# EAGLE design EE297 PCB (EAGLE 7.1.0)
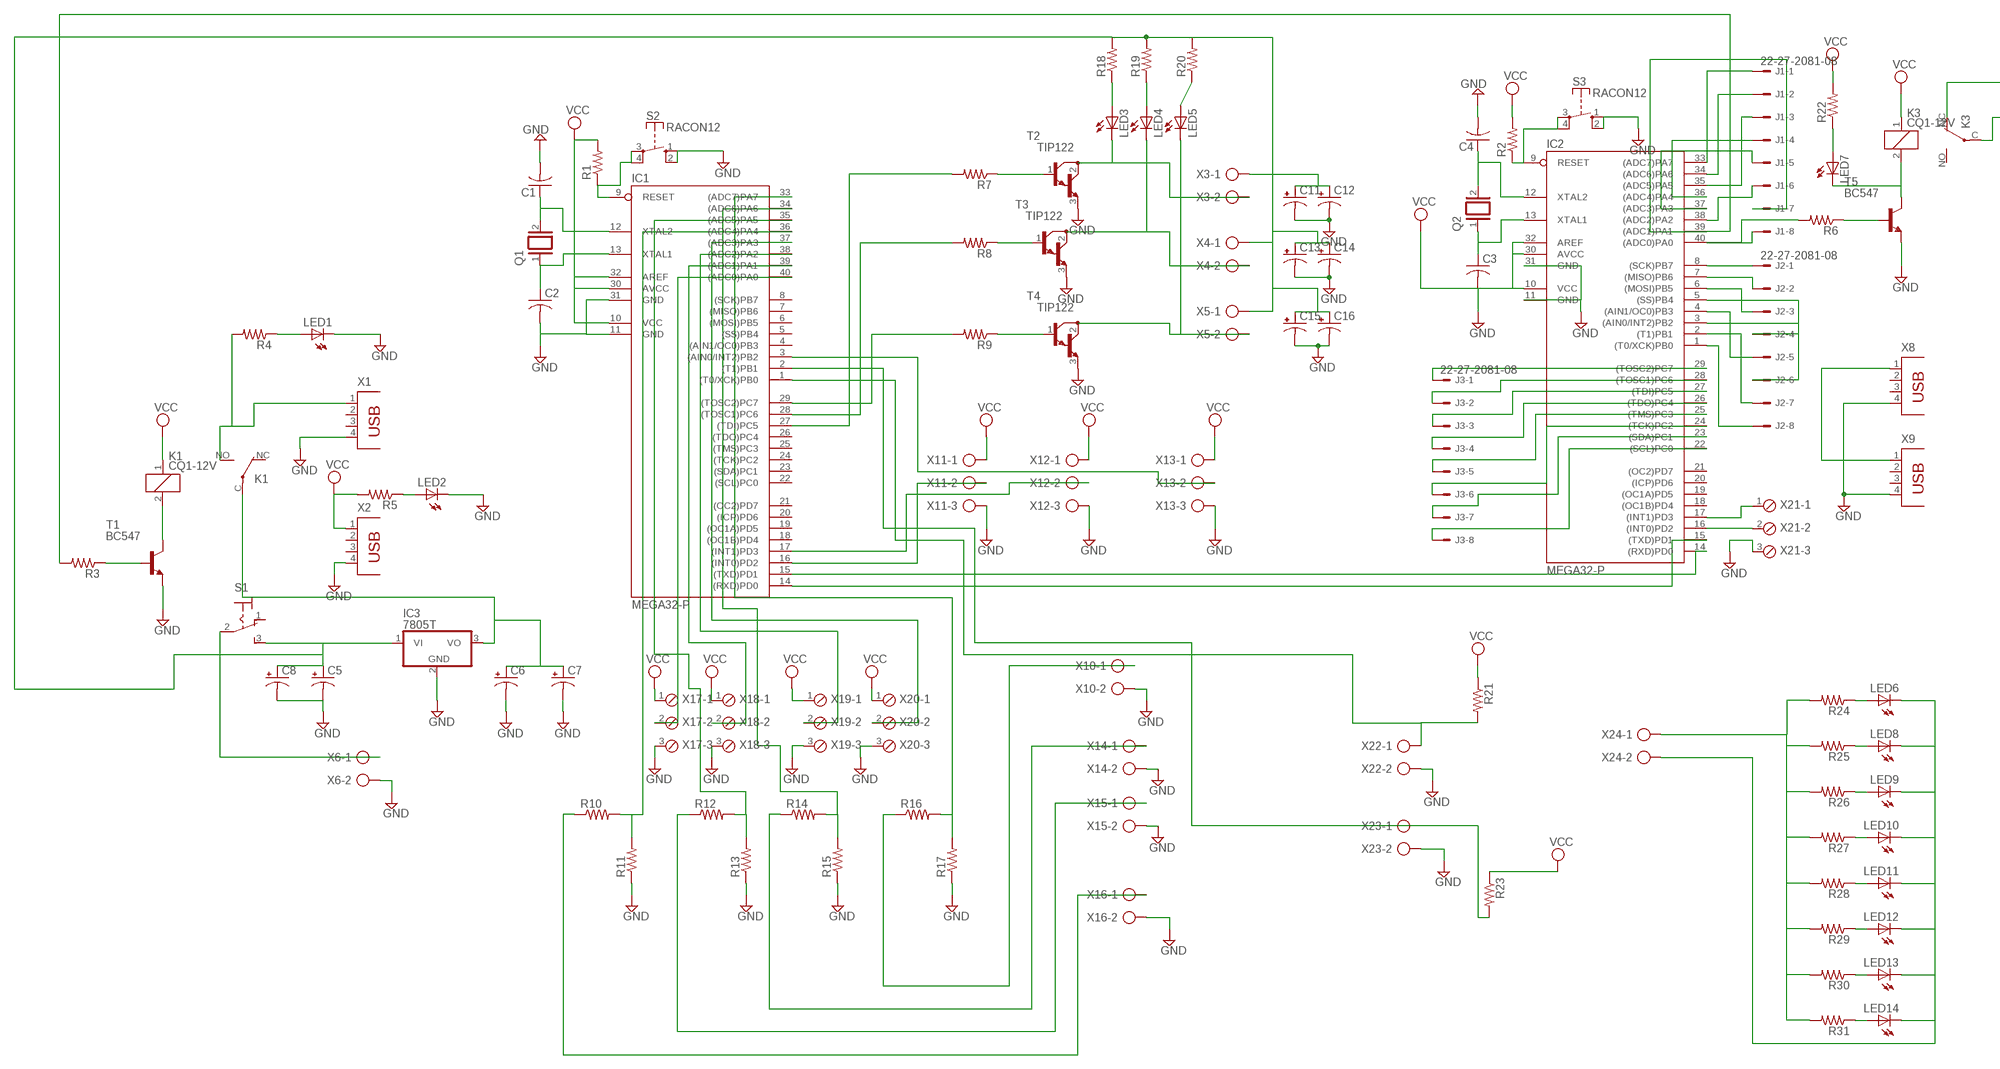
[diagram p0: schematic, sheet 1, part 1 of 2]
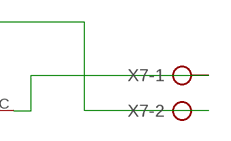
[diagram p1: schematic, sheet 1, part 2 of 2]

## Parts
C1  C-US050H075X075  [C050H075X075]
C2  C-US050H075X075  [C050H075X075]
C3  C-US050H075X075  [C050H075X075]
C4  C-US050H075X075  [C050H075X075]
C5  CPOL-USE7.5-18  [E7,5-18]
C6  CPOL-USE7.5-18  [E7,5-18]
C7  CPOL-USE7.5-18  [E7,5-18]
C8  CPOL-USE7.5-18  [E7,5-18]
C11  CPOL-USE7.5-18  [E7,5-18]
C12  CPOL-USE7.5-18  [E7,5-18]
C13  CPOL-USE7.5-18  [E7,5-18]
C14  CPOL-USE7.5-18  [E7,5-18]
C15  CPOL-USE7.5-18  [E7,5-18]
C16  CPOL-USE7.5-18  [E7,5-18]
IC1  MEGA32-P  [DIL40]
IC2  MEGA32-P  [DIL40]
IC3  7805T  [TO220H]
J1  22-27-2081-08  [6410-08]
J2  22-27-2081-08  [6410-08]
J3  22-27-2081-08  [6410-08]
K1  CQ1-12V  [CQ1]
K3  CQ1-12V  [CQ1]
LED1  LED5MM  [LED5MM]
LED2  LED5MM  [LED5MM]
LED3  LED5MM  [LED5MM]
LED4  LED5MM  [LED5MM]
LED5  LED5MM  [LED5MM]
LED6  LED5MM  [LED5MM]
LED7  LED5MM  [LED5MM]
LED8  LED5MM  [LED5MM]
LED9  LED5MM  [LED5MM]
LED10  LED5MM  [LED5MM]
LED11  LED5MM  [LED5MM]
LED12  LED5MM  [LED5MM]
LED13  LED5MM  [LED5MM]
LED14  LED5MM  [LED5MM]
Q1  XTAL  [Q]
Q2  XTAL  [Q]
R1  R-US_0207/10  [0207/10]
R2  R-US_0207/10  [0207/10]
R3  R-US_0207/10  [0207/10]
R4  R-US_0207/10  [0207/10]
R5  R-US_0207/10  [0207/10]
R6  R-US_0207/10  [0207/10]
R7  R-US_0207/10  [0207/10]
R8  R-US_0207/10  [0207/10]
R9  R-US_0207/10  [0207/10]
R10  R-US_0207/10  [0207/10]
R11  R-US_0207/10  [0207/10]
R12  R-US_0207/10  [0207/10]
R13  R-US_0207/10  [0207/10]
R14  R-US_0207/10  [0207/10]
R15  R-US_0207/10  [0207/10]
R16  R-US_0207/10  [0207/10]
R17  R-US_0207/10  [0207/10]
R18  R-US_0207/10  [0207/10]
R19  R-US_0207/10  [0207/10]
R20  R-US_0207/10  [0207/10]
R21  R-US_0207/10  [0207/10]
R22  R-US_0207/10  [0207/10]
R23  R-US_0207/10  [0207/10]
R24  R-US_0207/10  [0207/10]
R25  R-US_0207/10  [0207/10]
R26  R-US_0207/10  [0207/10]
R27  R-US_0207/10  [0207/10]
R28  R-US_0207/10  [0207/10]
R29  R-US_0207/10  [0207/10]
R30  R-US_0207/10  [0207/10]
R31  R-US_0207/10  [0207/10]
S1  320-916  [320-916]
S2  RACON12  [RACON12]
S3  RACON12  [RACON12]
T1  BC547  [TO92]
T2  TIP122  [TO220]
T3  TIP122  [TO220]
T4  TIP122  [TO220]
T5  BC547  [TO92]
X1  PN87520  [PN87520]
X2  PN87520  [PN87520]
X3  AK300/2  [AK300/2]
X4  AK300/2  [AK300/2]
X5  AK300/2  [AK300/2]
X6  AK300/2  [AK300/2]
X7  AK300/2  [AK300/2]
X8  PN87520  [PN87520]
X9  PN87520  [PN87520]
X10  AK300/2  [AK300/2]
X11  AK300/3  [AK300/3]
X12  AK300/3  [AK300/3]
X13  AK300/3  [AK300/3]
X14  AK300/2  [AK300/2]
X15  AK300/2  [AK300/2]
X16  AK300/2  [AK300/2]
X17  MPT3  [3POL254]
X18  MPT3  [3POL254]
X19  MPT3  [3POL254]
X20  MPT3  [3POL254]
X21  MPT3  [3POL254]
X22  AK300/2  [AK300/2]
X23  AK300/2  [AK300/2]
X24  AK300/2  [AK300/2]

## Nets
GND: C1.2 C2.2 C3.2 C4.2 C5.- C6.- C7.- C8.- C11.- C12.- C13.- C14.- C15.- C16.- IC1.11(GND) IC1.31(GND) IC3.2(GND) LED1.K(C) LED2.K(C) R11.1 R13.1 R15.1 R17.1 S2.1(S) S2.2(S) S3.1(S) S3.2(S) T1.1(E) T2.3(E) T3.3(E) T4.3(E) T5.1(E) X1.4 X2.4 X6.2 X8.4 X9.4 X10.2 X11.3 X12.3 X13.3 X14.2 X15.2 X16.2 X17.3 X18.3 X19.3 X20.3 X21.3 X22.2 X23.2
GND8: LED6.K(C) LED8.K(C) LED9.K(C) LED10.K(C) LED11.K(C) LED12.K(C) LED13.K(C) LED14.K(C) X24.2
N$1: S1.2(P) X6.1
N$2: K3.C(2:P) X7.1
N$3: C6.+ C7.+ IC3.3(VO) K1.C(2:P)
N$4: IC1.14((RXD)PD0) IC2.15((TXD)PD1)
N$5: R3.1 T1.2(B)
N$6: K1.2 T1.3(C)
N$7: K1.NO(2:S) R4.2 X1.1
N$8: IC1.9(RESET) R1.1 S2.3(P) S2.4(P)
N$9: IC1.1((T0/XCK)PB0) R21.2 X22.1
N$10: C1.1 IC1.12(XTAL2) Q1.2
N$11: C2.1 IC1.13(XTAL1) Q1.1
N$12: IC1.15((TXD)PD1) IC2.14((RXD)PD0)
N$13: IC1.40((ADC0)PA0) X17.2
N$14: IC2.9(RESET) R2.1 S3.3(P) S3.4(P)
N$15: IC1.39((ADC1)PA1) X18.2
N$16: IC1.38((ADC2)PA2) X19.2
N$17: C4.1 IC2.12(XTAL2) Q2.2
N$18: C3.1 IC2.13(XTAL1) Q2.1
N$19: IC1.37((ADC3)PA3) X20.2
N$20: IC1.2((T1)PB1) R23.2 X23.1
N$21: IC1.35((ADC5)PA5) R12.2 R13.2
N$22: IC1.34((ADC6)PA6) R14.2 R15.2
N$23: LED1.A R4.1
N$24: LED2.A R5.1
N$25: IC1.33((ADC7)PA7) R16.2 R17.2
N$26: IC2.11(GND) IC2.31(GND)
N$27: R6.1 T5.2(B)
N$28: K3.2 LED7.K(C) T5.3(C)
N$29: LED4.A R19.1
N$30: IC1.16((INT0)PD2) X11.2
N$31: IC1.17((INT1)PD3) X12.2
N$32: IC1.3((AIN0/INT2)PB2) X13.2
N$33: IC1.29((TOSC2)PC7) R9.2
N$34: IC1.28((TOSC1)PC6) R8.2
N$35: IC1.27((TDI)PC5) R7.2
N$36: R7.1 T2.1(B)
N$37: R8.1 T3.1(B)
N$38: R9.1 T4.1(B)
N$39: LED5.K(C) T4.2(C) X5.2
N$40: LED4.K(C) T3.2(C) X4.2
N$41: LED3.K(C) T2.2(C) X3.2
N$42: K3.NC(2:O) X7.2
N$43: LED5.A R20.1
N$44: IC2.40((ADC0)PA0) J1.8 R6.2
N$45: IC2.39((ADC1)PA1) J1.7 R3.2
N$46: IC2.17((INT1)PD3) X21.1
N$47: C5.+ C8.+ C11.+ C12.+ C13.+ C14.+ C15.+ C16.+ IC3.1(VI) R18.2 R19.2 R20.2 S1.3(S) X3.1 X4.1 X5.1
N$48: IC2.16((INT0)PD2) X21.2
N$49: X8.1 X9.1
N$50: LED3.A R18.1
N$51: R10.1 X16.1
N$52: R12.1 X15.1
N$53: R14.1 X14.1
N$54: R16.1 X10.1
N$55: IC1.36((ADC4)PA4) R10.2 R11.2
N$57: LED7.A R22.1
N$58: LED6.A R24.1
N$59: LED8.A R25.1
N$60: LED9.A R26.1
N$61: LED10.A R27.1
N$62: LED11.A R28.1
N$63: LED12.A R29.1
N$64: LED13.A R30.1
N$65: LED14.A R31.1
N$157: IC2.33((ADC7)PA7) J1.1
N$158: IC2.34((ADC6)PA6) J1.2
N$159: IC2.35((ADC5)PA5) J1.3
N$160: IC2.36((ADC4)PA4) J1.4
N$161: IC2.37((ADC3)PA3) J1.5
N$162: IC2.38((ADC2)PA2) J1.6
N$164: IC2.8((SCK)PB7) J2.1
N$165: IC2.7((MISO)PB6) J2.2
N$166: IC2.6((MOSI)PB5) J2.3
N$167: IC2.5((SS)PB4) J2.4
N$168: IC2.4((AIN1/OC0)PB3) J2.5
N$169: IC2.3((AIN0/INT2)PB2) J2.6
N$170: IC2.2((T1)PB1) J2.7
N$171: IC2.1((T0/XCK)PB0) J2.8
N$172: IC2.29((TOSC2)PC7) J3.1
N$173: IC2.28((TOSC1)PC6) J3.2
N$174: IC2.27((TDI)PC5) J3.3
N$175: IC2.26((TDO)PC4) J3.4
N$176: IC2.25((TMS)PC3) J3.5
N$177: IC2.24((TCK)PC2) J3.6
N$178: IC2.23((SDA)PC1) J3.7
N$179: IC2.22((SCL)PC0) J3.8
VCC: IC1.10(VCC) IC1.30(AVCC) IC1.32(AREF) IC2.10(VCC) IC2.30(AVCC) IC2.32(AREF) K1.1 K3.1 R1.2 R2.2 R5.2 R21.1 R22.2 R23.1 X2.1 X11.1 X12.1 X13.1 X17.1 X18.1 X19.1 X20.1
VCC8: R24.2 R25.2 R26.2 R27.2 R28.2 R29.2 R30.2 R31.2 X24.1
Unconnected: IC1.4((AIN1/OC0)PB3) IC1.5((SS)PB4) IC1.6((MOSI)PB5) IC1.7((MISO)PB6) IC1.8((SCK)PB7) IC1.18((OC1B)PD4) IC1.19((OC1A)PD5) IC1.20((ICP)PD6) IC1.21((OC2)PD7) IC1.22((SCL)PC0) IC1.23((SDA)PC1) IC1.24((TCK)PC2) IC1.25((TMS)PC3) IC1.26((TDO)PC4) IC2.18((OC1B)PD4) IC2.19((OC1A)PD5) IC2.20((ICP)PD6) IC2.21((OC2)PD7) K1.NC(2:O) K3.NO(2:S) S1.1(O) X1.2 X1.3 X2.2 X2.3 X8.2 X8.3 X9.2 X9.3

## Library data of the parts
C1-C4 = rcl:C-US: CAPACITOR, American symbol
C5-C8 C11-C16 = rcl:CPOL-US: POLARIZED CAPACITOR, American symbol
IC1 IC2 = atmel:MEGA32-P: MICROCONTROLLER 32 Kbytes FLASH 2 Kbytes SRAM 1 Kbytes EEPROM USART 8-channel 10 bit ADC Source: www.atmel.com .. doc2503.pdf; MPN: ATMEGA32-16PU; OC_FARNELL: 1661729; OC_NEWARK: 51P1794
IC3 = linear:78*: Positive VOLTAGE REGULATOR Source: http://cache.national.com/ds/LM/LM78L05.pdf http://www.fairchildsemi.com/ds/LM/LM7805.pdf
J1-J3 = con-molex:22-?-08: CONNECTOR wire to board 2.54 mm (.1 inch) pitch header; OC_FARNELL: unknown; OC_NEWARK: unknown
K1 K3 = relay:CQ1-12V: AUTOMOTIVE QUIET RELAY NAiS Source: http://www.mew-europe.com/.. en_ds_61208_0000.pdf; OC_FARNELL: unknown; OC_NEWARK: unknown
LED1-LED14 = led:LED: LED OSRAM: - CHIPLED LG R971, LG N971, LY N971, LG Q971, LY Q971, LO R971, LY R971 LH N974, LH R974 LS Q976, LO Q976, LY Q976 LO Q996 - Hyper CHIPLED LW Q18S LB Q993, LB Q99A, LB R99A - SideLED LS A670, LO A670, LY A670, LG A670, LP A670 LB A673, LV A673, LT A673, LW A673 LH A674 LY A675 LS A676, LA A676, LO A676, LY A676, LW A676 LS A679, LY A679, LG A679 - Hyper Micro SIDELED® LS Y876, LA Y876, LO Y876, LY Y876 LT Y87S - SmartLED LW L88C, LW L88S LB L89C, LB L89S, LG L890 LS L89K, LO L89K, LY L89K LS L896, LA L896, LO L896, LY L896 - TOPLED LS T670, LO T670, LY T670, LG T670, LP T670 LSG T670, LSP T670, LSY T670, LOP T670, LYG T670 LG T671, LOG T671, LSG T671 LB T673, LV T673, LT T673, LW T673 LH T674 LS T676, LA T676, LO T676, LY T676, LB T676, LH T676, LSB T676, LW T676 LB T67C, LV T67C, LT T67C, LS T67K, LO T67K, LY T67K, LW E67C LS E67B, LA E67B, LO E67B, LY E67B, LB E67C, LV E67C, LT E67C LW T67C LS T679, LY T679, LG T679 LS T770, LO T770, LY T770, LG T770, LP T770 LB T773, LV T773, LT T773, LW T773 LH T774 LS E675, LA E675, LY E675, LS T675 LS T776, LA T776, LO T776, LY T776, LB T776 LHGB T686 LT T68C, LB T68C - Hyper Mini TOPLED® LB M676 - Mini TOPLED Santana® LG M470 LS M47K, LO M47K, LY M47K Source: http://www.osram.convergy.de LUXEON: - LUMILED® LXK2-PW12-R00, LXK2-PW12-S00, LXK2-PW14-U00, LXK2-PW14-V00 LXK2-PM12-R00, LXK2-PM12-S00, LXK2-PM14-U00 LXK2-PE12-Q00, LXK2-PE12-R00, LXK2-PE12-S00, LXK2-PE14-T00, LXK2-PE14-U00 LXK2-PB12-K00, LXK2-PB12-L00, LXK2-PB12-M00, LXK2-PB14-N00, LXK2-PB14-P00, LXK2-PB14-Q00 LXK2-PR12-L00, LXK2-PR12-M00, LXK2-PR14-Q00, LXK2-PR14-R00 LXK2-PD12-Q00, LXK2-PD12-R00, LXK2-PD12-S00 LXK2-PH12-R00, LXK2-PH12-S00 LXK2-PL12-P00, LXK2-PL12-Q00, LXK2-PL12-R00 Source: www.luxeon.com KINGBRIGHT: KA-3528ASYC Source: www.kingbright.com
Q1 Q2 = special:XTAL: CRYSTAL
R1-R31 = rcl:R-US_: RESISTOR, American symbol
S1 = switch:320-916: TOGGLE SWITCH distributor RS Components
S2 S3 = switch-misc:RACON12: ITT SWITCH
T1 T5 = transistor:BC547: NPN TRANSISTOR
T2-T4 = transistor:TIP122: NPN BIPOLAR DARLINGTON TRANSISTOR
X1 X2 X8 X9 = con-berg:PN87520: BERG USB connector; OC_FARNELL: unknown; OC_NEWARK: unknown
X3-X7 X10 X14-X16 X22-X24 = con-ptr500:AK300/2: CONNECTOR; OC_FARNELL: unknown; OC_NEWARK: unknown
X11-X13 = con-ptr500:AK300/3: CONNECTOR; OC_FARNELL: unknown; OC_NEWARK: unknown
X17-X21 = con-phoenix-254:MPT3: PHOENIX CONNECTOR; OC_FARNELL: unknown; OC_NEWARK: unknown

## Board
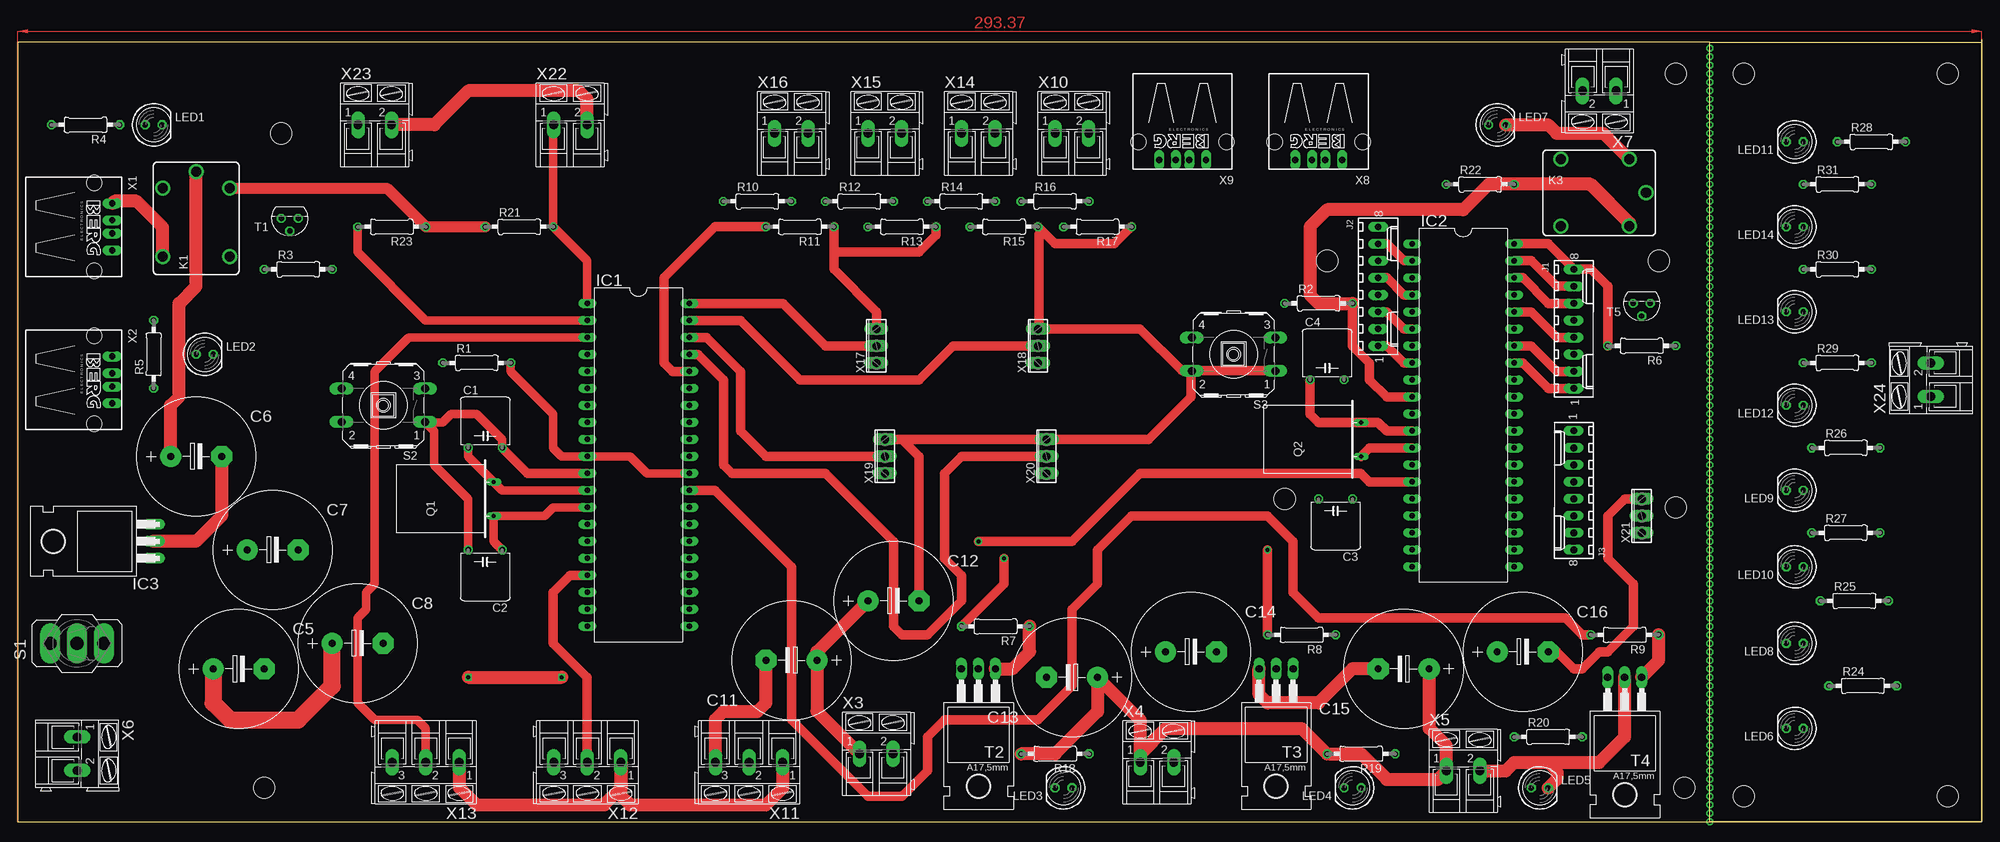
[diagram p2: board, top side]
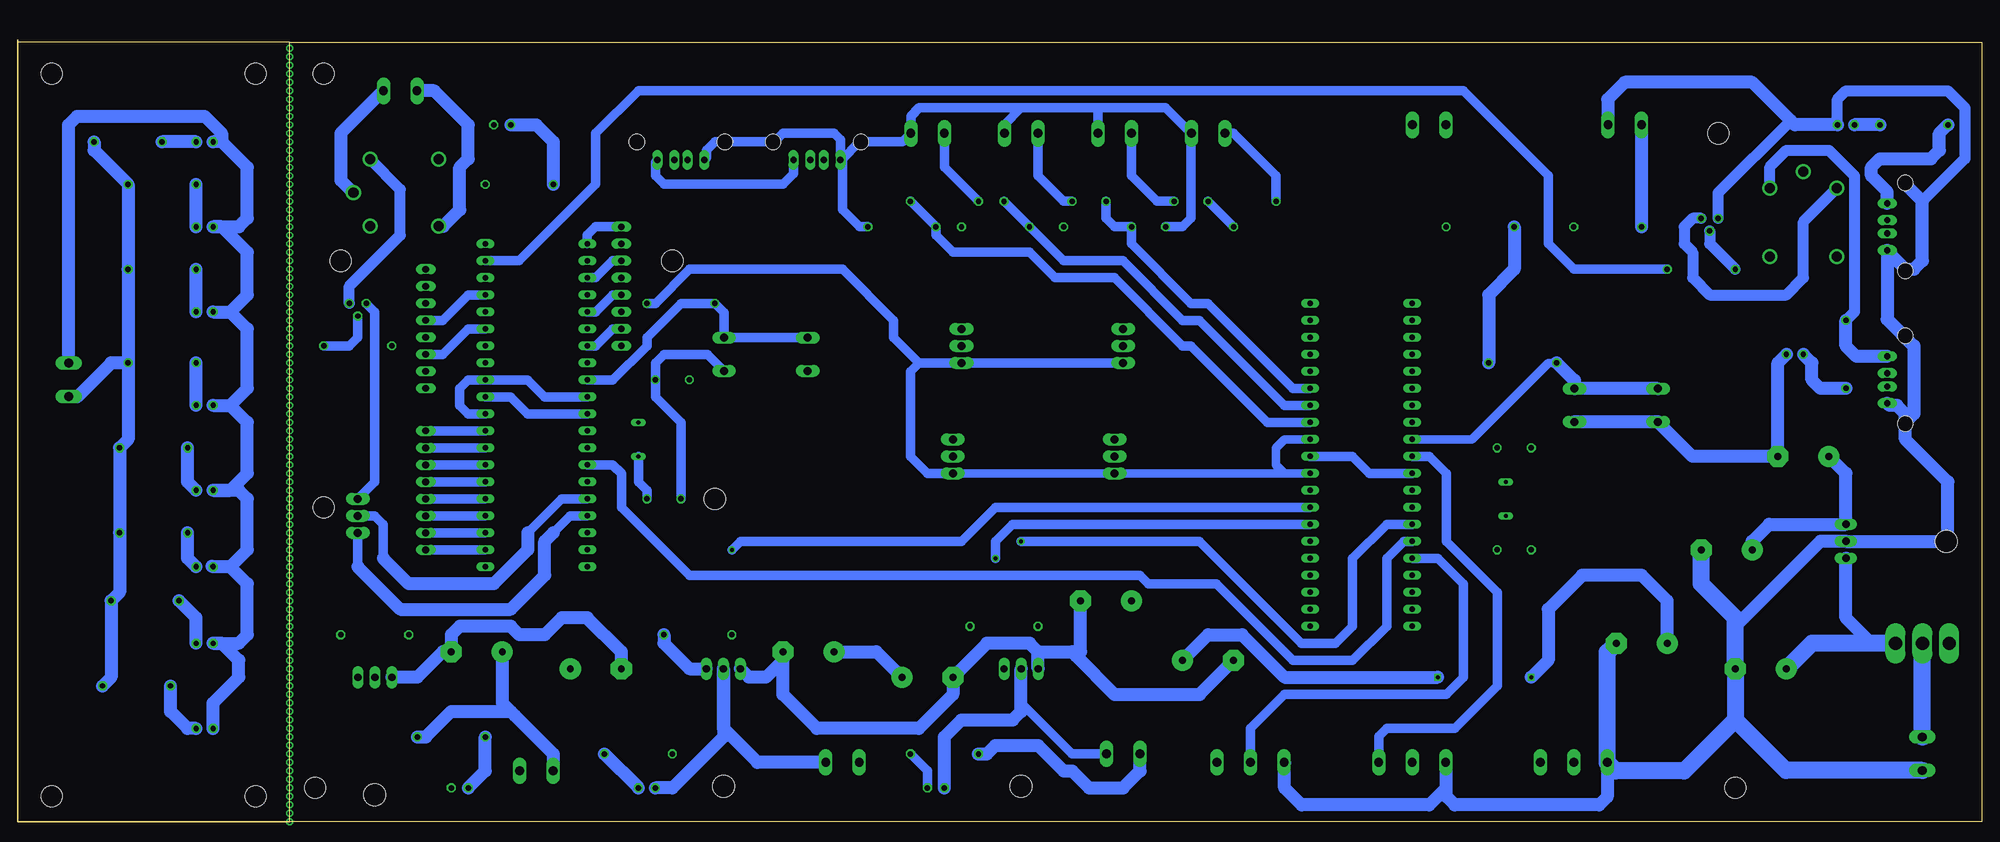
[diagram p3: board, bottom side, seen from below]

Size 293.37 x 116.84 mm. Coordinates in mm from the lower left corner, seen from the top.
Outline: 252.73,116.51 252.73,0 293.37,0 293.37,116.84 293.35,0 0,0 0,116.51 252.73,116.51
Outline: 252.73,116.51 293.35,116.51
Copper layers (1*16): Top 0.035mm / dielectric 1.5mm / Bottom 0.035mm
Design rules "default": minimum track width 10mil, minimum drill 24mil, track to track 8mil, track to pad 8mil, pad to pad 8mil, via to via 8mil, smd to smd 8mil, copper to edge 40mil, drill to drill 8mil, minimum pad ring 10mil, minimum via ring 8mil, stop-mask expansion 4mil, vias tented up to drill 0mil, thermal gap 10mil
Holes 3.2 mm at 39.37,102.87 36.83,5.08 247.65,111.76 248.92,5.08 288.29,3.81 257.81,3.81 288.29,111.76 257.81,111.76 195.58,83.82 245.11,83.82 247.65,46.99 189.23,48.26

### Footprints (pad centres in the part's own frame; a part is rotated, then mirrored left to right if it is on the bottom)
C050H075X075 = drill 0.813 octagon: 1 -2.54,0; 2 2.54,0
E7,5-18 = drill 1.016 pad 3.15: + -3.81,0 | drill 1.016 pad 3.15 octagon: - 3.81,0
DIL40 = drill 0.813 long: 1 -24.13,-7.62; 2 -21.59,-7.62; 3 -19.05,-7.62; 4 -16.51,-7.62; 5 -13.97,-7.62; 6 -11.43,-7.62; 7 -8.89,-7.62; 8 -6.35,-7.62; 9 -3.81,-7.62; 10 -1.27,-7.62; 11 1.27,-7.62; 12 3.81,-7.62; 13 6.35,-7.62; 14 8.89,-7.62; 15 11.43,-7.62; 16 13.97,-7.62; 17 16.51,-7.62; 18 19.05,-7.62; 19 21.59,-7.62; 20 24.13,-7.62; 21 24.13,7.62; 22 21.59,7.62; 23 19.05,7.62; 24 16.51,7.62; 25 13.97,7.62; 26 11.43,7.62; 27 8.89,7.62; 28 6.35,7.62; 29 3.81,7.62; 30 1.27,7.62; 31 -1.27,7.62; 32 -3.81,7.62; 33 -6.35,7.62; 34 -8.89,7.62; 35 -11.43,7.62; 36 -13.97,7.62; 37 -16.51,7.62; 38 -19.05,7.62; 39 -21.59,7.62; 40 -24.13,7.62
TO220H = drill 1.118 long: 1 -2.54,-10.16; 2 0,-10.16; 3 2.54,-10.16 | hole 3.302: 0,4.826
6410-08 = drill 1.016 long: 1 8.89,0; 2 6.35,0; 3 3.81,0; 4 1.27,0; 5 -1.27,0; 6 -3.81,0; 7 -6.35,0; 8 -8.89,0
CQ1 = drill 1.5: 1 4.5,-5; 2 4.5,5; C 7,0; NC -5.7,-5; NO -5.7,5
LED5MM = drill 0.813 octagon: A -1.27,0; K 1.27,0
Q = drill 0.61 long: 1 -2.54,-7.62; 2 2.54,-7.62
0207/10 = drill 0.813 octagon: 1 -5.08,0; 2 5.08,0
320-916 = drill 2.007 long: 1 0,4.013; 2 0,0; 3 0,-4.013
RACON12 = drill 1.194 long: 1 -6.248,2.489; 2 6.248,2.489; 3 -6.248,-2.489; 4 6.248,-2.489
TO92 = drill 0.813 octagon: 1 1.27,0; 2 0,1.905; 3 -1.27,0
TO220 = drill 1.118 long: 1 -2.54,-6.35; 2 0,-6.35; 3 2.54,-6.35 | hole 3.302: 0,11.176
PN87520 = drill 0.95 long: 1 -3.5,2.71; 2 -1,2.71; 3 1,2.71; 4 3.5,2.71 | hole 2.3: -6.57,0; 6.57,0
AK300/2 = drill 1.321 long: 1 -2.515,0; 2 2.489,0
AK300/3 = drill 1.321 long: 1 -5.004,0; 2 0,0; 3 5.004,0
3POL254 = drill 1.2 long: 1 -2.54,0; 2 0,0; 3 2.54,0

### Placement (x,y rotation side)
C1  69.85,55.88 0 top
C2  69.85,40.64 180 top
C3  196.85,48.26 180 top
C4  195.58,66.04 0 top
C5  33.02,22.86 0 top
C6  26.67,54.61 0 top
C7  38.1,40.64 0 top
C8  50.8,26.67 0 top
C11  115.57,24.13 180 top
C12  130.81,33.02 0 top
C13  157.48,21.59 180 top
C14  175.26,25.4 0 top
C15  207.01,22.86 180 top
C16  224.79,25.4 0 top
IC1  92.71,53.34 270 top
IC2  215.9,62.23 270 top
IC3  10.16,41.91 90 top
J1  232.41,73.66 270 top
J2  203.2,80.01 270 top
J3  232.41,49.53 90 top
K1  26.67,90.17 90 top
K3  236.22,93.98 0 top
LED1  20.32,104.14 0 top
LED2  27.94,69.85 0 top
LED3  156.21,5.08 180 top
LED4  199.39,5.08 180 top
LED5  227.33,5.08 0 top
LED6  265.43,13.97 180 top
LED7  220.98,104.14 0 top
LED8  265.43,26.67 180 top
LED9  265.43,49.53 180 top
LED10  265.43,38.1 180 top
LED11  265.43,101.6 180 top
LED12  265.43,62.23 180 top
LED13  265.43,76.2 180 top
LED14  265.43,88.9 180 top
Q1  63.5,48.26 90 top
Q2  193.04,57.15 90 top
R1  68.58,68.58 0 top
R2  194.31,77.47 0 top
R3  41.91,82.55 0 top
R4  10.16,104.14 180 top
R5  20.32,69.85 90 top
R6  242.57,71.12 180 top
R7  146.05,29.21 180 top
R8  191.77,27.94 180 top
R9  240.03,27.94 180 top
R10  110.49,92.71 0 top
R11  116.84,88.9 180 top
R12  125.73,92.71 0 top
R13  132.08,88.9 180 top
R14  140.97,92.71 0 top
R15  147.32,88.9 180 top
R16  154.94,92.71 0 top
R17  161.29,88.9 180 top
R18  154.94,10.16 180 top
R19  200.66,10.16 180 top
R20  228.6,12.7 0 top
R21  74.93,88.9 0 top
R22  218.44,95.25 0 top
R23  55.88,88.9 180 top
R24  275.59,20.32 0 top
R25  274.32,33.02 0 top
R26  273.05,55.88 0 top
R27  273.05,43.18 0 top
R28  276.86,101.6 0 top
R29  271.78,68.58 0 top
R30  271.78,82.55 0 top
R31  271.78,95.25 0 top
S1  8.89,26.67 90 top
S2  54.61,62.23 180 top
S3  181.61,69.85 180 top
T1  40.64,90.17 180 top
T2  143.51,16.51 180 top
T3  187.96,16.51 180 top
T4  240.03,15.24 180 top
T5  242.57,77.47 180 top
X1  11.43,88.9 270 top
X2  11.43,66.04 270 top
X3  128.27,10.16 0 top
X4  170.18,8.89 0 top
X5  215.9,7.62 0 top
X6  8.89,10.16 270 top
X7  236.22,109.22 180 top
X8  194.31,101.6 180 top
X9  173.99,101.6 180 top
X10  157.48,102.87 0 top
X11  109.22,8.89 180 top
X12  85.09,8.89 180 top
X13  60.96,8.89 180 top
X14  143.51,102.87 0 top
X15  129.54,102.87 0 top
X16  115.57,102.87 0 top
X17  128.27,71.12 90 top
X18  152.4,71.12 90 top
X19  129.54,54.61 90 top
X20  153.67,54.61 90 top
X21  242.57,45.72 90 top
X22  82.55,104.14 0 top
X23  53.34,104.14 0 top
X24  285.75,66.04 90 top

### Tracks (layer width: path | path; a pad name or v marks a point on that pad's centre or on a via)
GND
  Top 0.254: 152.55,87.78 152.55,88.7 R15.1 | 165.35,87.78 166.27,88.7 R17.1 | 175.41,67.44 S3.2 | 187.76,67.44 S3.1
  Top 1.27: C2.2 67.31,48.26 62.23,53.34 62.23,58.37 S2.1 60.91,59.69 63.5,59.69 64.77,60.96 68.58,60.96 72.39,57.15 C1.2 76.2,52.07
  Top 1.422: 187.76,67.44 175.44,67.44 S3.2 175.26,67.26 175.26,63.5 168.91,57.15 X20.3 132.08,57.15 | C12.- 134.62,54.61 132.08,57.15 | 132.08,57.15 X19.3 | X17.3 128.27,76.2 121.92,82.55 121.92,85.09 | 121.92,85.09 R11.1 | 152.55,87.78 152.55,73.81 X18.3 167.64,73.66 173.86,67.44 175.41,67.44 | R13.1 137.16,87.63 134.62,85.09 121.92,85.09 | R17.1 163.83,86.36 154.94,86.36 R15.1 | IC1.11 76.2,52.07 | C16.- 229.87,25.4 232.41,22.86 233.68,22.86 236.22,25.4 237.49,25.4 241.3,29.21 241.3,35.56 237.49,39.37 237.49,45.72 240.03,48.26 X21.3
  Top 1.93: C6.- 30.48,45.72 26.67,41.91 IC3.2 | X22.2 85.04,108 83.82,109.22 67.31,109.22 62.23,104.14 X23.2 | X11.3 104.22,15.32 105.41,16.51 110.49,16.51 111.76,17.78 C11.- | C15.- 199.39,22.86 194.31,17.78 186.69,17.78 185.42,19.05 T3.3
  Bottom 1.422: S3.1 190.35,69.85 196.85,69.85 198.12,68.58 C4.2 198.12,63.5 194.31,59.69 C3.2 | R11.1 119.38,88.9 118.11,90.17 118.11,102.82 X16.2 118.11,102.87 121.92,106.68 132.03,106.68 | X15.2 132.03,106.68 | 132.03,106.68 132.03,106.73 | X14.2 146,104.19 143.51,106.68 | 143.51,106.68 132.03,106.68 | 143.51,106.68 158.75,106.68 159.97,105.46 X10.2 161.24,101.6 167.64,101.6 170.35,98.89 X9.4 | R17.1 167.64,88.9 170.18,91.44 170.18,98.58 X9.4 | X9.4 170.49,101.91 171.45,102.87 179.07,102.87 180.34,101.6 189.23,101.6 190.5,100.33 190.5,99.2 X8.4 | IC1.31 93.98,54.61 91.44,52.07 IC1.11 | T5.1 240.03,76.2 240.03,50.8 X21.3
  Bottom 1.676: T1.1 39.37,93.98 28.57,104.78 | LED1.K 21.59,107.95 20.32,109.22 5.08,109.22 2.54,106.68 2.54,99.06 8.89,92.71
  Bottom 1.93: 36.83,29.21 24.13,41.91 IC3.2 5.08,41.91 5.08,50.8 11.43,57.15 11.43,59.69 | 11.43,59.69 11.43,60.96 12.7,62.23 13.83,62.23 X2.4 | LED2.K 30.48,68.58 C6.- 43.23,54.61 S2.2 S2.1 | 11.43,59.69 10.16,60.96 10.16,71.12 14.14,75.1 X1.4 14.14,85.26 11.43,82.55 10.16,82.55 8.89,83.82 8.89,92.71 11.43,95.25 | LED1.K 27.94,104.14 28.57,104.78 34.29,110.49 53.34,110.49 55.88,107.95 55.88,104.19 X23.2 | X13.3 55.96,3.73 57.15,2.54 78.74,2.54 80.01,3.81 80.01,8.81 X12.3 80.09,5 82.55,2.54 101.6,2.54 104.14,5.08 104.14,8.81 X11.3 | 135.25,24.77 135.89,25.4 140.97,25.4 | 135.25,24.77 129.54,19.05 116.84,19.05 C11.- | T2.3 140.97,25.4 | 140.97,25.4 142.24,26.67 148.59,26.67 C13.- 153.67,19.05 158.75,13.97 173.99,13.97 179.07,19.05 C14.- 179.07,24.13 181.61,21.59 184.15,21.59 T3.3 | 135.25,24.77 134.62,25.4 C12.- | T4.3 233.68,21.59 229.87,25.4 C16.- 228.6,27.94 227.33,29.21 219.71,29.21 218.44,27.94 214.63,27.94 212.09,30.48 208.28,30.48 203.2,25.4 C15.-
  Bottom 2.54: X6.2 29.26,7.67 36.83,15.24 | 36.83,15.24 C5.- 36.83,29.21 36.83,30.48 41.91,35.56 C7.- | 36.83,15.24 44.45,7.62 54.69,7.62 X13.3 55.96,25.32 C8.-
GND8  (via drill 0.6)
  Top 0.254: v264.34,38.18 LED10.K | 264.34,49.38 LED9.K
  Bottom 1.93: LED6.K 264.16,17.78 260.35,21.59 260.35,24.13 262.89,26.67 LED8.K 260.35,26.67 259.08,27.94 259.08,35.56 261.62,38.1 LED10.K | v264.34,38.18 261.54,38.18 259.08,40.64 259.08,48.26 260.35,49.53 LED9.K 261.62,49.53 259.08,52.07 259.08,59.69 261.62,62.23 | LED12.K 261.62,62.23 | 261.62,62.23 259.08,64.77 259.08,73.66 261.62,76.2 | LED13.K 261.62,76.2 | 261.62,76.2 259.08,78.74 259.08,85.09 262.89,88.9 LED14.K 260.35,88.9 259.08,90.17 259.08,97.79 262.89,101.6 | 262.89,101.6 LED11.K | X24.2 285.75,104.14 284.48,105.41 265.43,105.41 262.89,102.87 262.89,101.6
N$1
  Bottom 2.54: X6.1 S1.2
N$2
  Bottom 1.93: X7.1 238.76,109.22 245.11,102.87 245.11,95.87 K3.C
N$3
  Top 1.93: C6.+ 22.86,62.23 24.13,63.5 24.13,77.47 26.67,80.01 K1.C
  Bottom 1.93: C7.+ 34.29,41.91 31.75,44.45 IC3.3 20.32,52.07 C6.+
N$4  (via drill 0.6)
  Top 1.422: IC2.15 201.93,50.8 200.66,52.07 167.64,52.07 157.48,41.91 v143.51,41.91
  Bottom 1.422: v143.51,41.91 116.84,41.91 101.6,26.67 96.52,26.67 93.98,29.21 93.98,39.37 88.9,44.45 IC1.14
N$5
  Bottom 1.676: T1.2 40.64,86.36 R3.1
N$6
  Bottom 1.676: T1.3 43.18,90.17 44.45,88.9 44.45,86.36 43.18,85.09 43.18,81.28 40.64,78.74 29.21,78.74 26.67,81.28 26.67,89.67 K1.2
N$7
  Top 1.93: K1.NO 21.67,88.82 17.78,92.71 14.45,92.71 X1.1
  Bottom 1.93: X1.1 14.14,94.15 16.51,96.52 16.51,97.79 15.24,99.06 7.62,99.06 6.35,100.33 6.35,102.87 R4.2
N$8
  Bottom 1.27: R1.1 64.77,68.58 76.2,57.15 IC1.9
  Bottom 1.93: S2.4 S2.3 60.86,65.94 R1.1
N$9
  Top 1.27: IC1.1 85.09,83.82 R21.2 80.01,104.11 X22.1
N$10
  Top 0.254: 84.89,49.61 IC1.12
  Top 1.27: C1.1 67.31,54.61 Q1.2 72.39,49.53 IC1.12
N$11
  Top 1.27: C2.1 71.12,41.91 Q1.1 78.74,45.72 80.01,46.99 IC1.13
N$12
  Bottom 1.422: IC1.15 86.36,41.91 88.9,39.37 88.9,29.21 93.98,24.13 102.87,24.13 114.3,35.56 124.46,35.56 125.73,36.83 193.04,36.83 203.2,46.99 203.2,52.07 204.47,53.34 IC2.14
N$13
  Top 1.422: IC1.40 114.3,77.47 120.65,71.12 X17.2
N$14
  Bottom 1.422: IC2.9 204.47,66.04 199.39,71.12 199.39,72.39 194.31,77.47 R2.1 187.86,76.1 S3.3 | 187.91,72.39 S3.3 | S3.4 S3.3
N$15
  Top 1.422: X18.2 139.7,71.12 134.62,66.04 116.84,66.04 107.95,74.93 IC1.39
N$16
  Top 1.422: X19.2 111.76,54.61 107.95,58.42 107.95,67.31 102.87,72.39 IC1.38
N$17
  Top 1.422: C4.1 193.04,60.96 194.31,59.69 Q2.2 203.2,59.69 204.47,58.42 IC2.12
N$18
  Top 0.254: 200.56,54.41 Q2.1
  Top 1.422: IC2.13 201.93,55.88 Q2.1
  Bottom 1.422: C3.1 199.39,49.53 200.66,50.8 Q2.1
N$19
  Top 1.422: X20.2 140.97,54.61 138.43,52.07 138.43,39.37 140.97,36.83 140.97,33.02 135.89,27.94 132.08,27.94 130.81,29.21 130.81,41.91 120.65,52.07 106.68,52.07 105.41,53.34 105.41,66.04 101.6,69.85 IC1.37
N$20
  Top 1.27: R23.2 50.8,85.09 60.96,74.93 IC1.2
  Bottom 1.93: X23.1 50.82,88.92 R23.2
N$21
  Bottom 1.422: IC1.35 102.87,64.77 115.57,77.47 118.11,77.47 127,86.36 R13.2 129.54,88.9 130.81,90.17 R12.2
N$22
  Bottom 1.422: IC1.34 104.14,62.23 116.84,74.93 119.38,74.93 128.27,83.82 137.16,83.82 R15.2 R14.2
N$23
  Bottom 1.93: R4.1 LED1.A
N$24
  Bottom 1.93: R5.1 24.13,64.77 25.4,66.04 25.4,68.58 LED2.A
N$25
  Bottom 1.422: IC1.33 106.68,59.69 118.11,71.12 119.38,71.12 129.54,81.28 138.43,81.28 142.24,85.09 153.67,85.09 156.21,87.63 R17.2 R16.2
N$26
  Bottom 1.422: IC2.11 217.17,60.96 219.71,63.5 IC2.31
N$27
  Bottom 1.422: R6.1 243.84,71.12 242.57,72.39 T5.2
N$28
  Top 1.93: LED7.K 228.6,104.14 229.87,102.87 236.83,102.87 K3.2
  Bottom 1.676: T5.3 243.84,80.01 236.22,87.63 236.22,94.48 K3.2
N$29
  Bottom 1.93: R19.1 LED4.A
N$30
  Bottom 1.422: IC1.16 81.28,39.37 77.47,35.56 77.47,21.59 80.01,19.05 104.14,19.05 109.22,13.97 X11.2
N$31
  Top 1.422: X12.2 85.09,21.59 80.01,26.67 80.01,34.29 82.55,36.83 IC1.17
N$32
  Top 1.27: IC1.3 58.42,72.39 53.34,67.31 53.34,35.56 52.07,34.29 52.07,31.75 50.8,30.48 50.8,17.78 53.34,15.24 59.69,15.24 60.96,13.97 X13.2
N$33
  Top 1.422: R9.2 233.68,27.94 231.14,30.48 194.31,30.48 190.5,34.29 190.5,41.91 186.69,45.72 166.37,45.72 161.29,40.64 161.29,35.56 157.48,31.75 157.48,20.32 152.4,15.24 138.43,15.24 135.89,12.7 135.89,7.62 132.08,3.81 127,3.81 115.57,15.24 115.57,38.1 104.14,49.53 IC1.29
N$34  (via drill 0.6)
  Top 1.422: v186.69,40.64 R8.2
  Bottom 1.422: IC1.28 147.32,46.99 152.4,41.91 185.42,41.91 v186.69,40.64
N$35  (via drill 0.6)
  Top 1.422: v147.32,39.37 147.32,35.56 R7.2
  Bottom 1.422: IC1.27 144.78,44.45 147.32,41.91 v147.32,39.37
N$36
  Top 1.93: T2.1 148.59,22.86 151.13,25.4 R7.1
N$37
  Bottom 1.93: R8.1 196.85,26.67 193.04,22.86 T3.1
N$38
  Top 1.93: T4.1 245.11,24.13 R9.1
N$39
  Top 1.93: X5.2 222.25,7.62 223.52,8.89 228.6,8.89 | 228.6,8.89 229.87,7.62 229.87,6.35 LED5.K | 228.6,8.89 236.22,8.89 240.03,12.7 T4.2
N$40
  Bottom 1.93: X4.2 182.88,8.89 187.96,13.97 T3.2 187.96,12.7 195.58,5.08 LED4.K
N$41
  Bottom 1.422: T2.2 143.51,17.78 135.89,10.16 X3.2
  Bottom 1.93: LED3.K 154.94,12.7 152.4,15.24 144.78,15.24 143.51,16.51 T2.2
N$42
  Bottom 1.93: K3.NC 229.79,88.98 227.33,91.44 227.33,97.79 226.06,99.06 226.06,104.14 231.14,109.22 X7.2
N$43
  Bottom 1.93: LED5.A 223.52,7.62 R20.1
N$44
  Top 1.422: IC2.40 228.6,86.36 J1.8 234.95,82.55 237.49,80.01 R6.2
N$45
  Top 1.422: J1.7 229.87,80.01 226.06,83.82 IC2.39
  Bottom 1.422: R3.2 60.96,82.55 64.77,86.36 64.77,96.52 77.47,109.22 200.66,109.22 207.01,102.87 207.01,95.25 218.44,83.82 IC2.39
N$46
  Bottom 1.422: X21.1 242.57,38.1 | 213.36,43.18 210.82,45.72 IC2.17
  Bottom 1.93: 242.57,38.1 236.22,31.75 219.71,31.75 214.63,36.83 214.63,41.91 213.36,43.18
N$47  (via drill 0.6)
  Top 1.93: X3.1 119.38,16.54 C11.+ 119.38,25.4 C12.+ | v67.31,21.59 v81.28,21.59 | R18.2 154.94,10.16 161.29,16.51 C13.+ 167.64,15.24 167.64,8.91 X4.1 167.66,10.19 171.45,13.97 191.77,13.97 R19.2 200.66,10.16 204.47,6.35 212.12,6.35 X5.1 213.38,11.4 210.82,13.97 C15.+
  Top 2.54: C5.+ 29.21,17.78 31.75,15.24 41.91,15.24 46.99,20.32 C8.+
  Bottom 1.93: 16.51,26.67 20.32,30.48 IC3.1 | C8.+ 46.99,33.02 50.8,36.83 59.69,36.83 64.77,31.75 64.77,24.13 v67.31,21.59 | C11.+ 115.57,27.94 110.49,27.94 104.14,21.59 v81.28,21.59 | C14.+ 165.1,25.4 C13.+ | R18.2 148.59,10.16 147.32,11.43 140.97,11.43 137.16,7.62 135.89,7.62 133.35,5.08 128.27,5.08 125.73,7.62 125.73,10.13 X3.1 | R20.2 232.41,12.7 228.6,16.51 219.74,16.51 | 219.74,16.51 219.09,15.86 213.38,10.16 X5.1 | C16.+ 220.98,17.75 219.74,16.51
  Bottom 2.54: C5.+ 25.4,26.67 16.51,26.67 S1.3
N$48
  Bottom 1.422: IC2.16 212.09,48.26 217.17,43.18 | 238.76,39.37 238.76,44.45 240.03,45.72 X21.2
  Bottom 1.93: 217.17,43.18 217.17,40.64 222.25,35.56 234.95,35.56 238.76,39.37
N$49
  Bottom 1.422: X9.1 177.49,96.83 179.07,95.25 196.85,95.25 198.12,96.52 198.12,98.58 X8.1
N$50
  Bottom 1.422: LED3.A 157.48,7.62 R18.1
N$51
  Bottom 1.422: X16.1 111.76,102.87 105.41,96.52 R10.1
N$52
  Bottom 1.422: R12.1 123.19,92.71 127,96.52 127,102.84 X15.1
N$53
  Bottom 1.422: R14.1 137.16,92.71 140.97,96.52 140.97,102.84 X14.1
N$54
  Bottom 1.422: R16.1 154.94,97.79 154.94,102.89 | 154.94,104.14 154.94,102.89 | 154.94,102.89 X10.1
N$55
  Top 1.422: IC1.36 97.79,67.31 96.52,68.58 96.52,81.28 104.14,88.9 R11.2
  Bottom 1.422: R10.2 R11.2
N$56  (via drill 0.6)
  other vias: 252.73,115.57
N$57
  Bottom 1.93: LED7.A 215.9,104.14 213.36,101.6 R22.1
N$58
  Bottom 1.93: LED6.A 267.97,13.97 270.51,16.51 R24.1
N$59
  Bottom 1.93: LED8.A 266.7,30.48 R25.1
N$60
  Bottom 1.93: LED9.A 267.97,50.8 R26.1
N$61
  Bottom 1.93: LED10.A 267.97,39.37 R27.1
N$62
  Bottom 1.93: LED11.A R28.1
N$63
  Bottom 1.93: LED12.A R29.1
N$64
  Bottom 1.93: LED13.A R30.1
N$65
  Bottom 1.93: LED14.A R31.1
N$66  (via drill 0.6)
  other vias: 252.73,114.3
N$67  (via drill 0.6)
  other vias: 252.73,113.03
N$68  (via drill 0.6)
  other vias: 252.73,111.76
N$69  (via drill 0.6)
  other vias: 252.73,110.49
N$70  (via drill 0.6)
  other vias: 252.73,109.22
N$71  (via drill 0.6)
  other vias: 252.73,107.95
N$72  (via drill 0.6)
  other vias: 252.73,105.41
N$73  (via drill 0.6)
  other vias: 252.73,104.14
N$74  (via drill 0.6)
  other vias: 252.73,106.68
N$75  (via drill 0.6)
  other vias: 252.73,102.87
N$76  (via drill 0.6)
  other vias: 252.73,101.6
N$77  (via drill 0.6)
  other vias: 252.73,100.33
N$78  (via drill 0.6)
  other vias: 252.73,99.06
N$79  (via drill 0.6)
  other vias: 252.73,97.79
N$80  (via drill 0.6)
  other vias: 252.73,96.52
N$81  (via drill 0.6)
  other vias: 252.73,95.25
N$82  (via drill 0.6)
  other vias: 252.73,93.98
N$83  (via drill 0.6)
  other vias: 252.73,92.71
N$84  (via drill 0.6)
  other vias: 252.73,90.17
N$85  (via drill 0.6)
  other vias: 252.73,88.9
N$86  (via drill 0.6)
  other vias: 252.73,91.44
N$87  (via drill 0.6)
  other vias: 252.73,87.63
N$88  (via drill 0.6)
  other vias: 252.73,86.36
N$89  (via drill 0.6)
  other vias: 252.73,85.09
N$90  (via drill 0.6)
  other vias: 252.73,83.82
N$91  (via drill 0.6)
  other vias: 252.73,82.55
N$92  (via drill 0.6)
  other vias: 252.73,81.28
N$93  (via drill 0.6)
  other vias: 252.73,80.01
N$94  (via drill 0.6)
  other vias: 252.73,78.74
N$95  (via drill 0.6)
  other vias: 252.73,77.47
N$96  (via drill 0.6)
  other vias: 252.73,74.93
N$97  (via drill 0.6)
  other vias: 252.73,73.66
N$98  (via drill 0.6)
  other vias: 252.73,76.2
N$99  (via drill 0.6)
  other vias: 252.73,72.39
N$100  (via drill 0.6)
  other vias: 252.73,71.12
N$101  (via drill 0.6)
  other vias: 252.73,69.85
N$102  (via drill 0.6)
  other vias: 252.73,68.58
N$103  (via drill 0.6)
  other vias: 252.73,67.31
N$104  (via drill 0.6)
  other vias: 252.73,66.04
N$105  (via drill 0.6)
  other vias: 252.73,64.77
N$106  (via drill 0.6)
  other vias: 252.73,63.5
N$107  (via drill 0.6)
  other vias: 252.73,62.23
N$108  (via drill 0.6)
  other vias: 252.73,59.69
N$109  (via drill 0.6)
  other vias: 252.73,58.42
N$110  (via drill 0.6)
  other vias: 252.73,60.96
N$111  (via drill 0.6)
  other vias: 252.73,57.15
N$112  (via drill 0.6)
  other vias: 252.73,55.88
N$113  (via drill 0.6)
  other vias: 252.73,54.61
N$114  (via drill 0.6)
  other vias: 252.73,53.34
N$115  (via drill 0.6)
  other vias: 252.73,52.07
N$116  (via drill 0.6)
  other vias: 252.73,50.8
N$117  (via drill 0.6)
  other vias: 252.73,49.53
N$118  (via drill 0.6)
  other vias: 252.73,46.99
N$119  (via drill 0.6)
  other vias: 252.73,45.72
N$120  (via drill 0.6)
  other vias: 252.73,48.26
N$121  (via drill 0.6)
  other vias: 252.73,44.45
N$122  (via drill 0.6)
  other vias: 252.73,43.18
N$123  (via drill 0.6)
  other vias: 252.73,41.91
N$124  (via drill 0.6)
  other vias: 252.73,40.64
N$125  (via drill 0.6)
  other vias: 252.73,39.37
N$126  (via drill 0.6)
  other vias: 252.73,38.1
N$127  (via drill 0.6)
  other vias: 252.73,36.83
N$128  (via drill 0.6)
  other vias: 252.73,35.56
N$129  (via drill 0.6)
  other vias: 252.73,34.29
N$130  (via drill 0.6)
  other vias: 252.73,31.75
N$131  (via drill 0.6)
  other vias: 252.73,30.48
N$132  (via drill 0.6)
  other vias: 252.73,33.02
N$133  (via drill 0.6)
  other vias: 252.73,29.21
N$134  (via drill 0.6)
  other vias: 252.73,27.94
N$135  (via drill 0.6)
  other vias: 252.73,26.67
N$136  (via drill 0.6)
  other vias: 252.73,25.4
N$137  (via drill 0.6)
  other vias: 252.73,24.13
N$138  (via drill 0.6)
  other vias: 252.73,22.86
N$139  (via drill 0.6)
  other vias: 252.73,21.59
N$140  (via drill 0.6)
  other vias: 252.73,20.32
N$141  (via drill 0.6)
  other vias: 252.73,19.05
N$142  (via drill 0.6)
  other vias: 252.73,16.51
N$143  (via drill 0.6)
  other vias: 252.73,15.24
N$144  (via drill 0.6)
  other vias: 252.73,17.78
N$145  (via drill 0.6)
  other vias: 252.73,13.97
N$146  (via drill 0.6)
  other vias: 252.73,12.7
N$147  (via drill 0.6)
  other vias: 252.73,11.43
N$148  (via drill 0.6)
  other vias: 252.73,10.16
N$149  (via drill 0.6)
  other vias: 252.73,8.89
N$150  (via drill 0.6)
  other vias: 252.73,7.62
N$151  (via drill 0.6)
  other vias: 252.73,6.35
N$152  (via drill 0.6)
  other vias: 252.73,5.08
N$153  (via drill 0.6)
  other vias: 252.73,3.81
N$154  (via drill 0.6)
  other vias: 252.73,1.27
N$155  (via drill 0.6)
  other vias: 252.73,0
N$156  (via drill 0.6)
  other vias: 252.73,2.54
N$157
  Top 1.422: IC2.33 224.79,68.58 228.6,64.77 J1.1
N$158
  Top 1.422: J1.2 229.87,67.31 226.06,71.12 IC2.34
N$159
  Bottom 1.422: IC2.35 226.06,73.66 229.87,69.85 J1.3
N$160
  Top 1.422: J1.4 229.87,72.39 226.06,76.2 IC2.36
N$161
  Bottom 1.422: IC2.37 226.06,78.74 229.87,74.93 J1.5
N$162
  Top 1.422: J1.6 228.6,77.47 224.79,81.28 IC2.38
N$164
  Top 1.422: J2.1 204.47,71.12 207.01,68.58 IC2.8
N$165
  Bottom 1.422: IC2.7 207.01,71.12 204.47,73.66 J2.2
N$166
  Top 1.422: J2.3 204.47,76.2 207.01,73.66 IC2.6
N$167
  Bottom 1.422: J2.4 204.47,78.74 207.01,76.2 IC2.5
N$168
  Top 1.422: J2.5 204.47,81.28 207.01,78.74 IC2.4
N$169
  Bottom 1.422: IC2.3 207.01,81.28 204.47,83.82 J2.6
N$170
  Top 1.422: J2.7 204.47,86.36 207.01,83.82 IC2.2
N$171
  Bottom 1.422: J2.8 207.01,88.9 208.28,87.63 IC2.1
N$172
  Bottom 1.422: J3.1 IC2.29
N$173
  Bottom 1.422: IC2.28 J3.2
N$174
  Bottom 1.422: J3.3 IC2.27
N$175
  Bottom 1.422: IC2.26 J3.4
N$176
  Bottom 1.422: J3.5 IC2.25
N$177
  Bottom 1.422: J3.6 IC2.24
N$178
  Bottom 1.422: IC2.23 J3.7
N$179
  Bottom 1.422: J3.8 IC2.22
VCC
  Top 1.27: R1.2 73.66,67.31 80.01,60.96 80.01,55.88 81.28,54.61 IC1.10 91.44,54.61 93.98,52.07 IC1.30
  Top 1.422: R22.2 234.45,95.25 K3.1 | IC2.10 204.47,63.5 201.93,66.04 201.93,68.58 199.39,71.12 R2.2
  Top 1.676: K1.1 55.19,94.67 R23.1 R21.1
  Top 1.93: X13.1 65.96,5.16 68.58,2.54 87.63,2.54 90.17,5.08 90.17,8.81 X12.1 90.09,3.89 91.44,2.54 111.76,2.54 114.3,5.08 114.3,8.81 X11.1 | K3.1 240.72,89.48 234.95,95.25 219.71,95.25 215.9,91.44 195.58,91.44 193.04,88.9 193.04,78.74 194.31,77.47 R2.2
  Bottom 1.27: IC1.32 104.14,57.15 105.41,55.88 105.41,53.34 104.14,52.07 IC1.30 X19.1 X20.1
  Bottom 1.422: X12.1 90.09,12.78 88.9,13.97 78.74,13.97 72.39,20.32 72.39,34.29 80.01,41.91 80.01,52.07 82.55,54.61 IC1.10 | IC2.10 214.63,63.5 217.17,66.04 IC2.32 226.06,66.04 227.33,64.77 227.33,62.23 226.06,60.96 IC2.30 | X17.1 X18.1 158.75,68.58 | 158.75,68.58 162.56,72.39 162.56,74.93 170.18,82.55 193.04,82.55 198.12,77.47 R2.2 | X20.1 157.48,52.07 160.02,54.61 160.02,67.31 158.75,68.58
  Bottom 1.676: K1.1 31.67,97.87 29.21,100.33 22.86,100.33 19.05,96.52 19.05,76.2 R5.2
  Bottom 1.93: X2.1 18.74,69.54 20.32,71.12 R5.2 | R21.1 69.85,82.55 73.66,78.74 R1.2
VCC8
  Bottom 1.93: R28.2 281.94,100.33 R31.2 R30.2 R29.2 | R29.2 276.86,57.15 R26.2 R27.2 278.13,34.29 R25.2 279.4,21.59 R24.2 | R29.2 279.4,68.58 284.48,63.5 285.73,63.5 X24.1
(copper drawn outside any net)
  shapes: Top area x2